# Altium schematic sheet SDCARD.SchDoc
size A
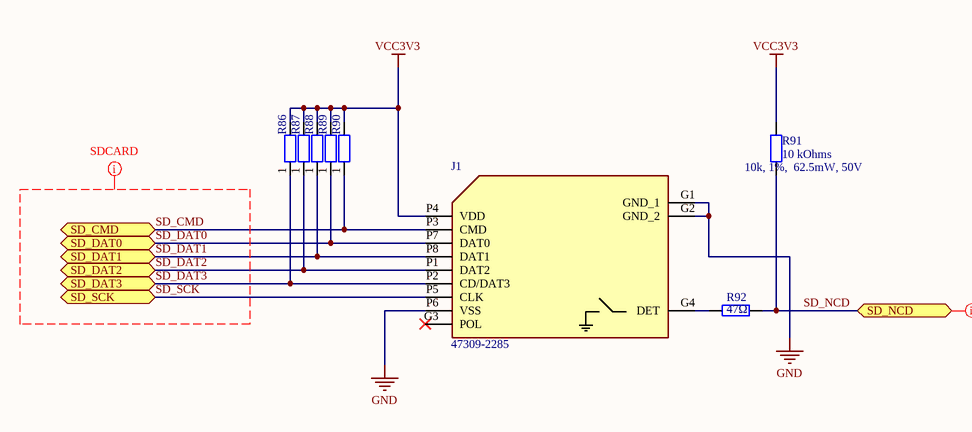
[diagram p0: SDCARD.SchDoc]

## Parts
J1  47309-2285  [473092285]
R86  100 kOhms  [RES0402i]  (value not drawn)
R87  100 kOhms  [RES0402i]  (value not drawn)
R88  100 kOhms  [RES0402i]  (value not drawn)
R89  100 kOhms  [RES0402i]  (value not drawn)
R90  100 kOhms  [RES0402i]  (value not drawn)
R91  10 kOhms  value 10k, 1%,  62.5mW, 50V  [RES0402i]
R92  47Ω  [0805_R]

## Ports
SD_CMD (bidir), SD_DAT0 (bidir), SD_DAT1 (bidir), SD_DAT2 (bidir), SD_DAT3 (bidir), SD_NCD (bidir), SD_SCK (bidir)

## Nets
GND: J1.G1(GND_1) J1.G2(GND_2) J1.P6(VSS)
VCC3V3: J1.P4(VDD) R86.2 R87.2 R88.2 R89.2 R90.2 R91.2
SD_CMD: J1.P3(CMD) R90.1 ; port SD_CMD
SD_DAT0: J1.P7(DAT0) R89.1 ; port SD_DAT0
SD_DAT1: J1.P8(DAT1) R88.1 ; port SD_DAT1
SD_DAT2: J1.P1(DAT2) R87.1 ; port SD_DAT2
SD_DAT3: J1.P2(CD/DAT3) R86.1 ; port SD_DAT3
SD_NCD: R91.1 R92.2 ; port SD_NCD
SD_SCK: J1.P5(CLK) ; port SD_SCK
NetJ1_G4: J1.G4(DET) R92.1

Not connected (* = marked no-connect by the designer): J1 G3(POL)*

## Layout directives
net class SD-CARD: SD_CMD, SD_DAT0, SD_DAT1, SD_DAT2, SD_DAT3, SD_NCD, SD_SCK

## Library data of the parts
J1 = 47309-2285: 1.10mm Pitch microSD Card Header with Detect Pin Height 2.85mm Lead-Free Gold (Au) Plated 0.762; Manufacturer_Name: Molex; Datasheet Link: https://www.molex.com/pdm_docs/sd/473092285_sd.pdf; Height: 2.85mm; Manufacturer_Part_Number: 47309-2285; Mouser Part Number: 538-47309-2285; Mouser Price/Stock: https://www.mouser.co.uk/ProductDetail/Molex/47309-2285?qs=yd8XiKYcH9k6mrof3cUHRA%3D%3D; Supplier 1: Mouser; Manufacturer: Molex; Manufacturer Part Number: 47309-2285; RoHS: Yes; Category: Memory Connectors; Stock 1: 8870; Pricing 1: 1=2.29, 10=1.83, 50=1.83, 100=1.64, 1000=1.64, 10000=1.12 (USD); Supplier Part Number 1: 538-47309-2285
R86-R90 = Res_100K_1%_0402: 0402, 100k, 1%, 62.5mW, 50V; Part Number: CR0402-FX-1003GLF; Manufacturer 1: Bourns; Temperature Coefficient: 100 PPM / C; Package: 0402 (1005 Metric); Voltage: 50 V; Tolerance: ±1%; Operating Temperature: -55°C ~ 125°C; Mounting Type: SMT; Supplier 1: Mouser; Supplier Part Number 1: 652-CR0402FX-1003GLF; Manufacturer Part Number 1: CR0402-FX-1003GLF; Component Type: Generic; Resistance: 100 kOhms; Note: *; Supplier 2: DigiKey; Supplier 3: Farnell; Supplier Part Number 2: CR0402-FX-1003GLFCT-ND; Supplier Part Number 3: 2787798; Value: 100k,1%,62.5mW,50V
R91 = Res_10k_1%_0402: 0402, 10K 1%,  62.5mW, 50V; Part Number: CR0402-FX-1002GLF; Manufacturer 1: Bourns; Temperature Coefficient: 100 PPM / C; Package: 0402 (1005 Metric); Voltage: 50V; Tolerance: ±1%; Operating Temperature: -55°C ~ 125°C; Mounting Type: SMT; Supplier 1: Mouser; Supplier Part Number 1: 652-CR0402FX-1002GLF; Manufacturer Part Number 1: CR0402-FX-1002GLF; Component Type: Generic; Resistance: 10 kOhms; Note: *; Supplier 2: DigiKey; Supplier 3: Farnell; Supplier Part Number 2: CR0402-FX-1002GLFCT-ND; Supplier Part Number 3: 2333566
R92 = 0805 47Ω (47R0) 1%: 贴片电阻; ComponentLink1Description: 供应商链接; ComponentLink1URL: http://www.szlcsc.com/product/details_18402.html; Package: 0805; Supplier: LC; SuppliersPartNumber: C17714